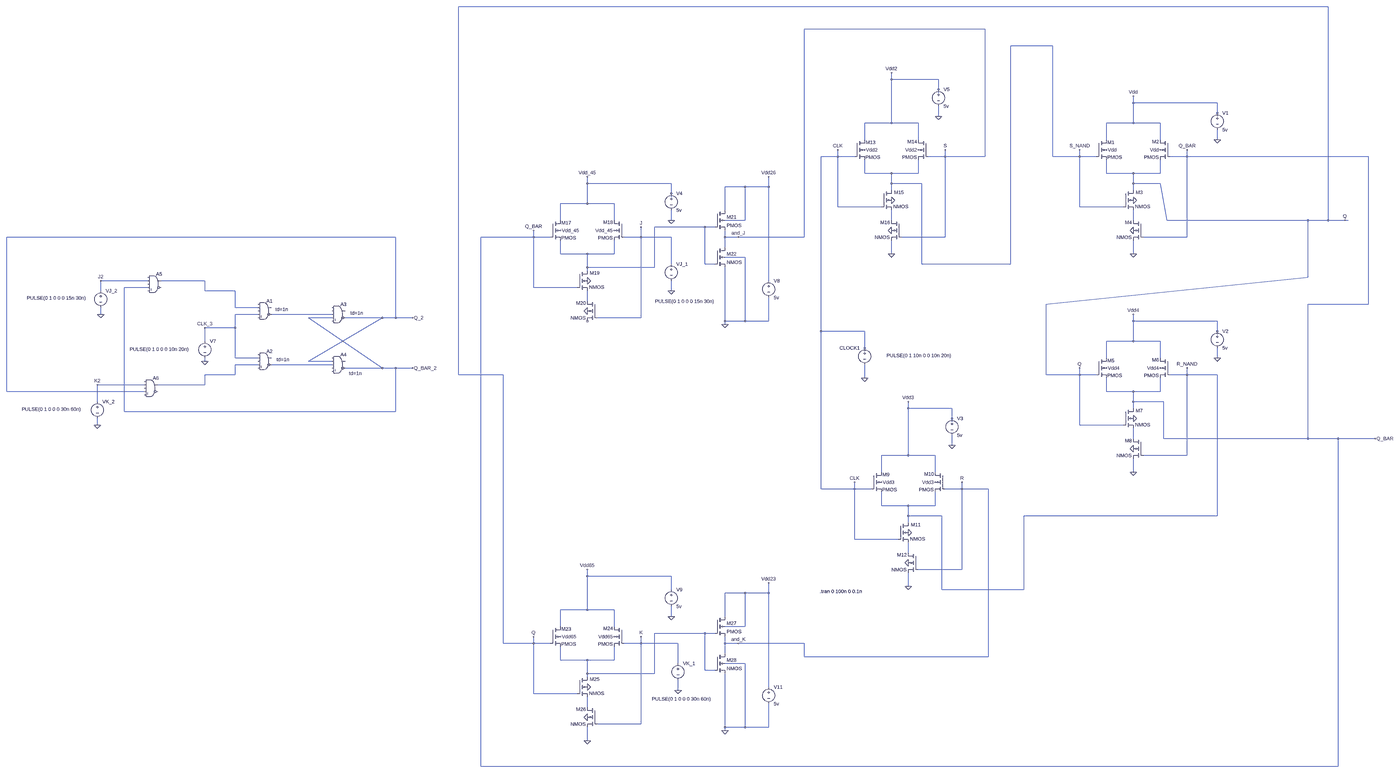
[diagram p0: schematic Latch-JK.asc, whole sheet]
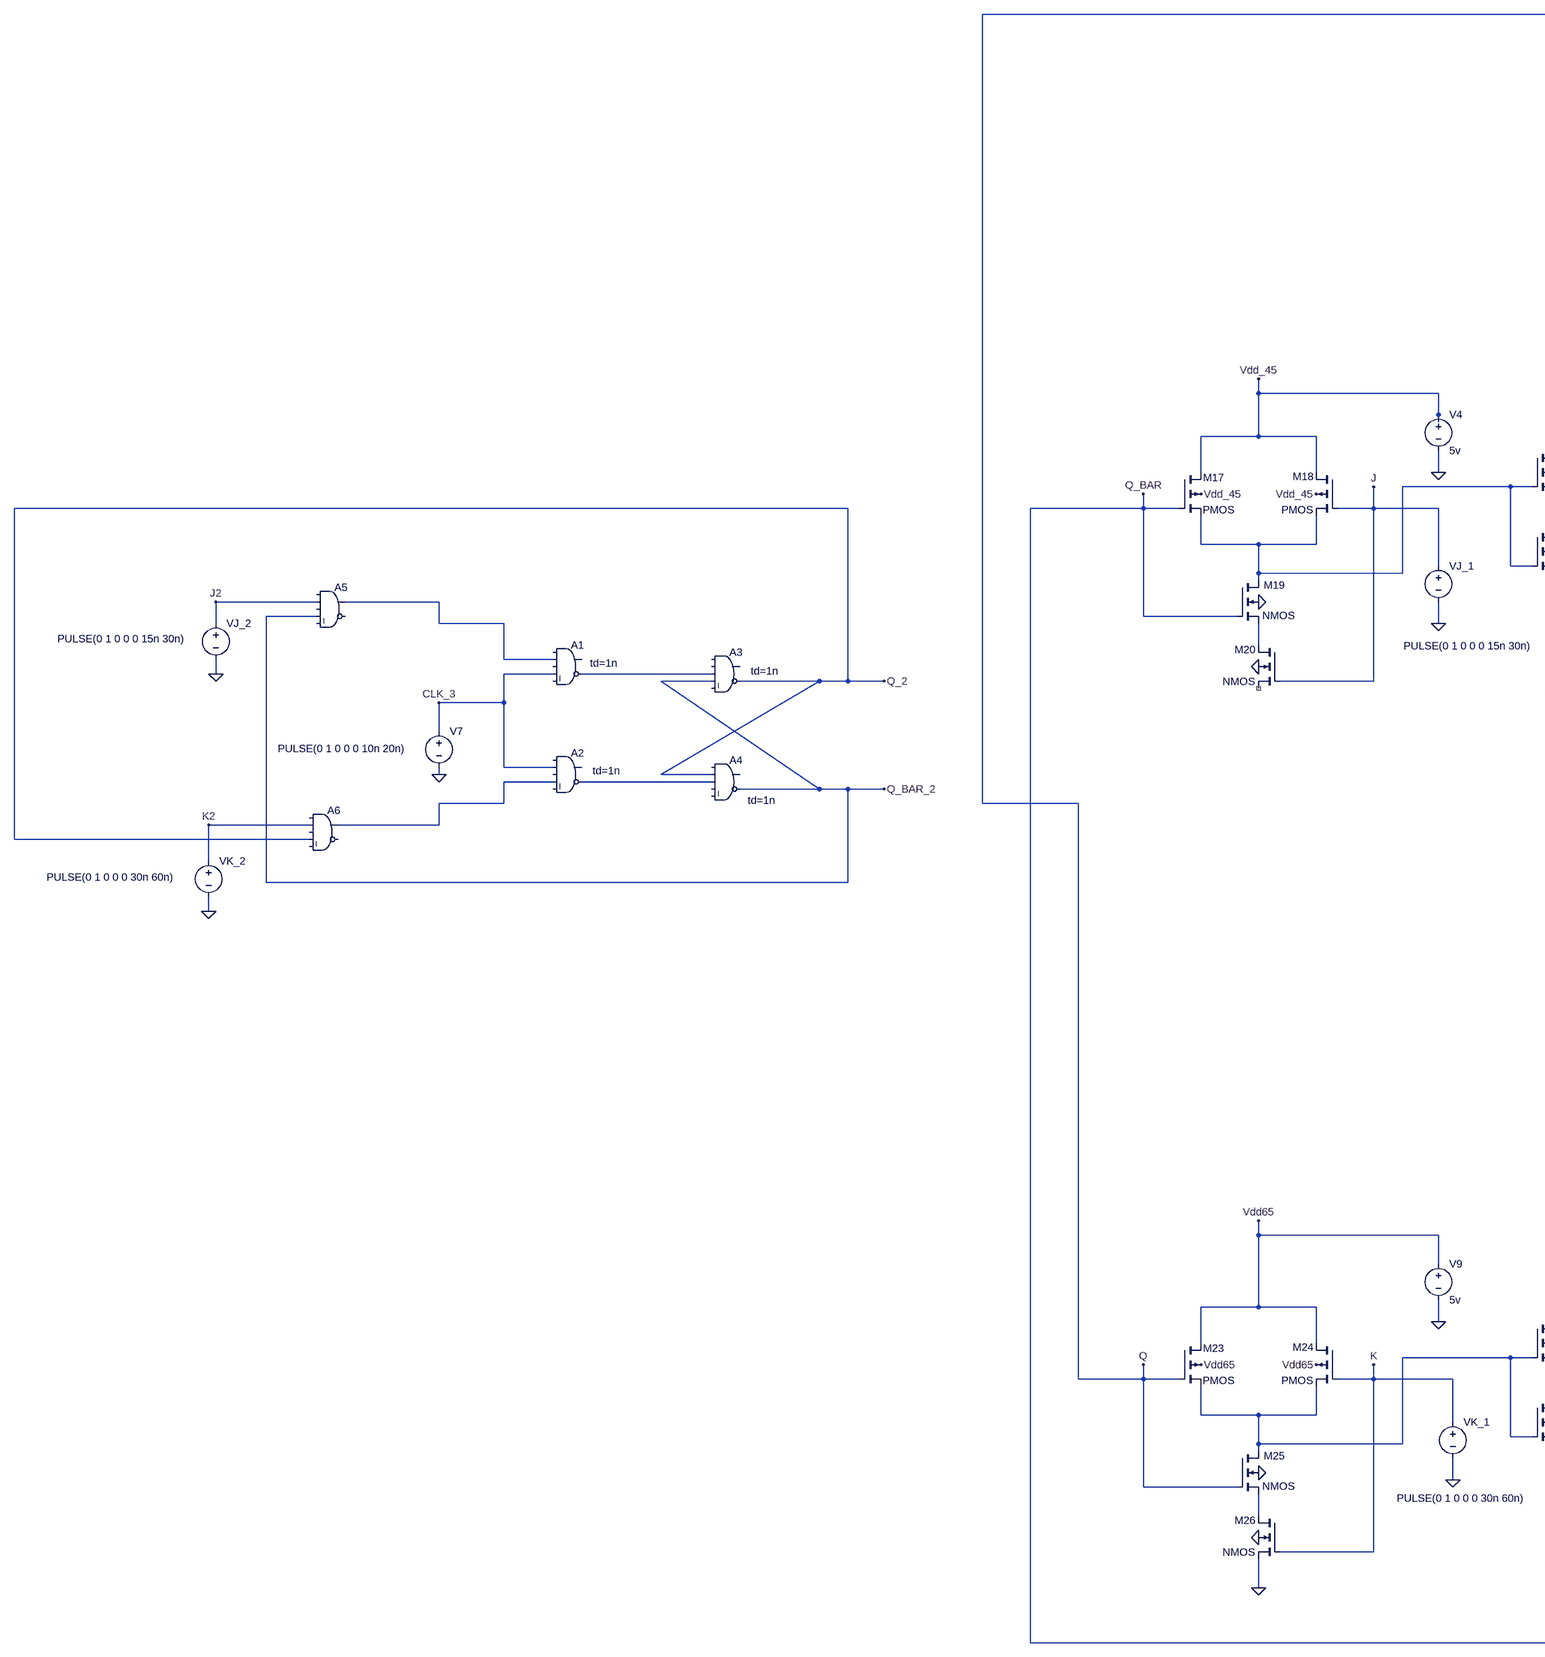
[diagram p1: schematic Latch-JK.asc, part, row 1 of 1, column 1 of 2]
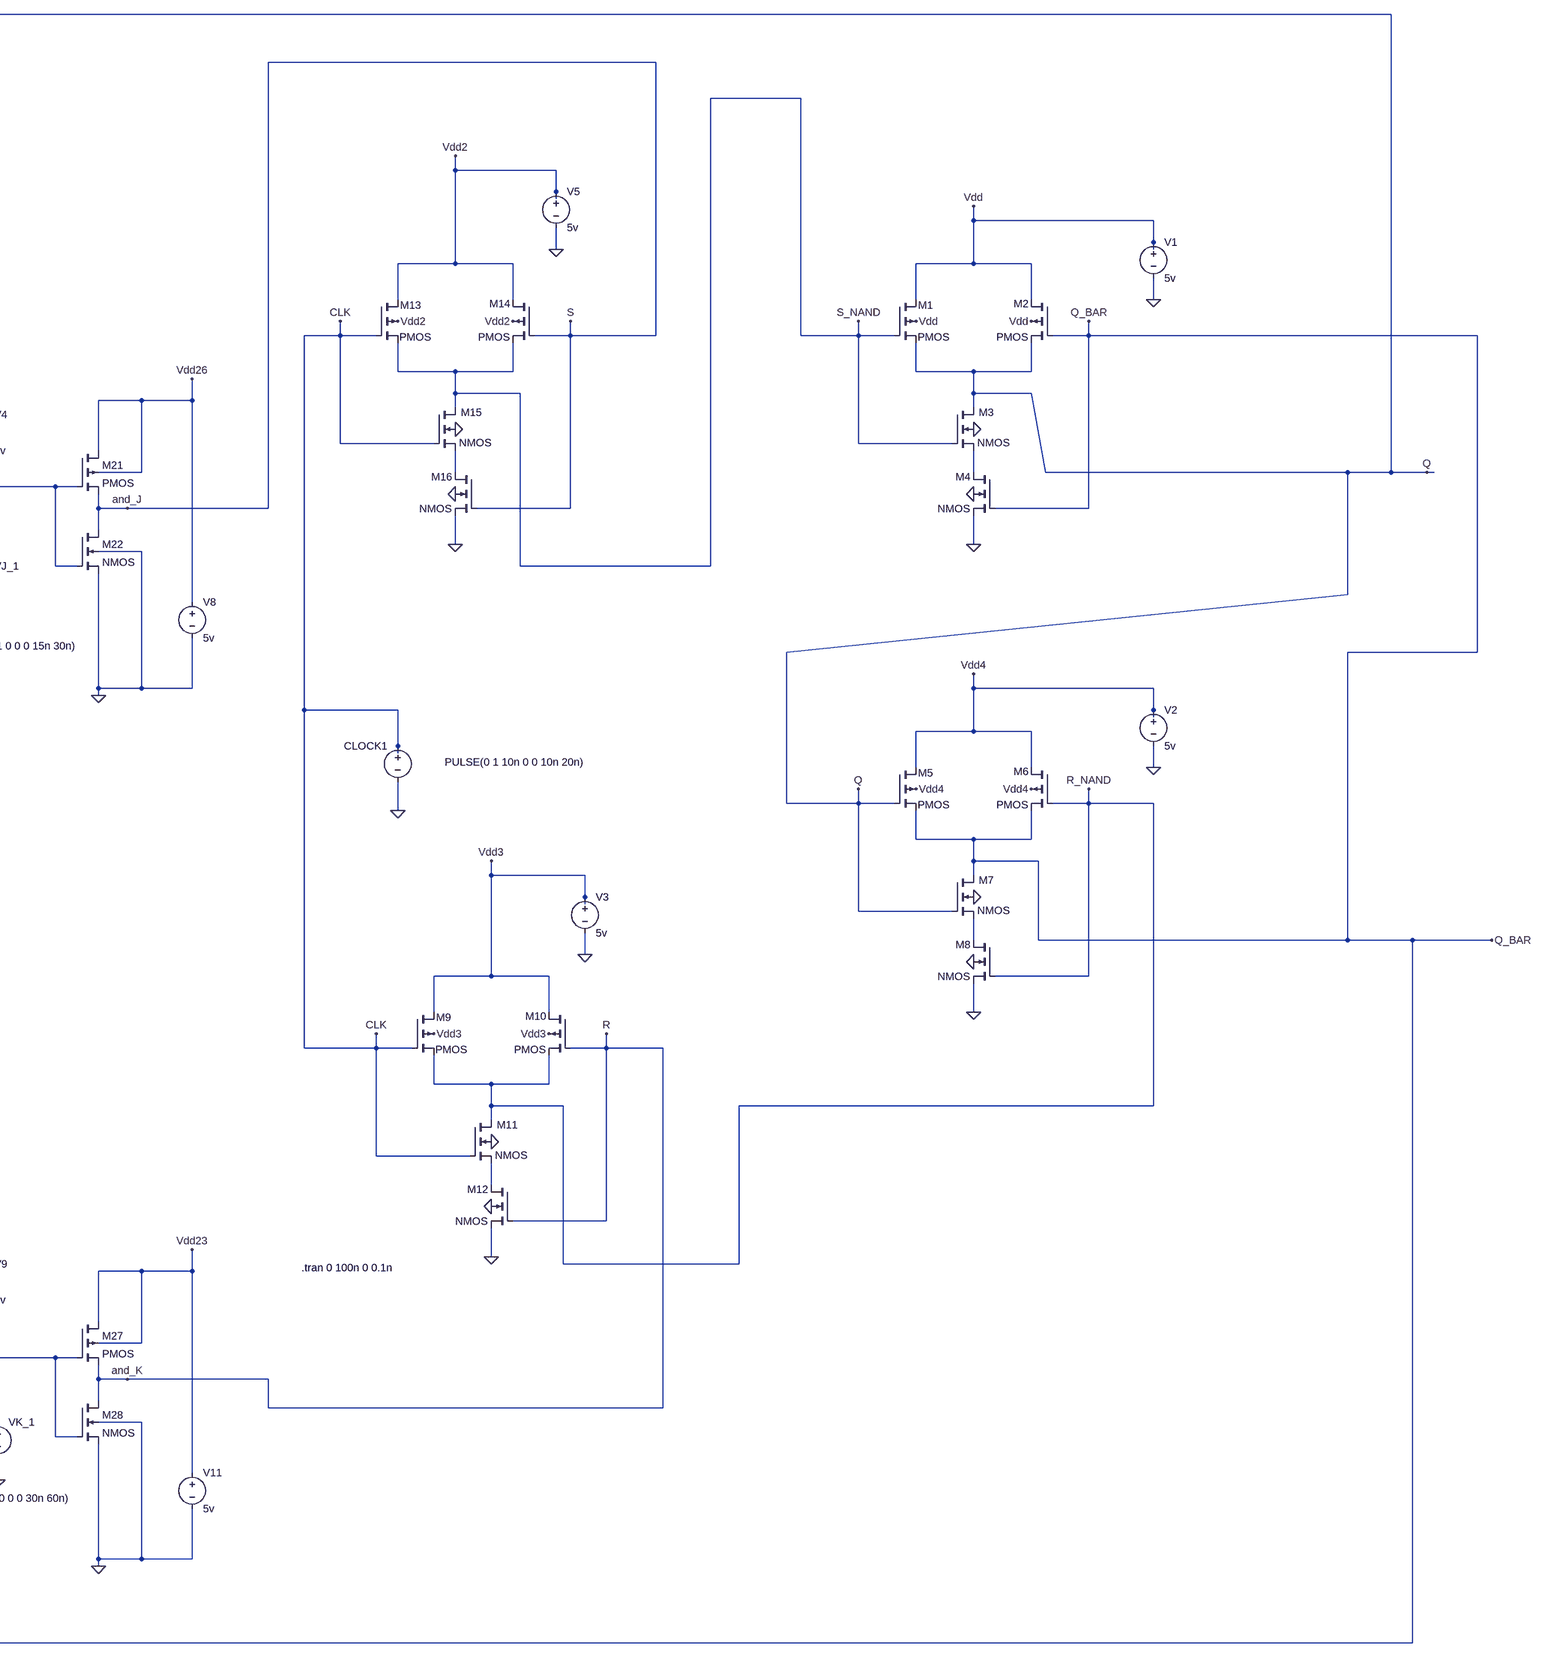
[diagram p2: schematic Latch-JK.asc, part, row 1 of 1, column 2 of 2]
Latch-JK.asc, the LTspice schematic file:
Version 4
SHEET 1 3092 2708
WIRE 2768 -1280 -2736 -1280
WIRE 480 -912 -400 -912
WIRE 1456 -832 608 -832
WIRE 16 -672 16 -704
WIRE 240 -672 16 -672
WIRE 240 -624 240 -672
WIRE 240 -608 240 -624
WIRE 1840 -560 1840 -592
WIRE 2240 -560 1840 -560
WIRE 2240 -512 2240 -560
WIRE 240 -496 240 -544
WIRE 2240 -496 2240 -512
WIRE 16 -464 16 -672
WIRE 16 -464 -112 -464
WIRE 144 -464 16 -464
WIRE 1840 -464 1840 -560
WIRE 1840 -464 1712 -464
WIRE 1968 -464 1840 -464
WIRE -112 -384 -112 -464
WIRE 144 -384 144 -464
WIRE 1712 -384 1712 -464
WIRE 1968 -384 1968 -464
WIRE 2240 -384 2240 -432
WIRE -240 -304 -240 -336
WIRE -240 -304 -320 -304
WIRE -160 -304 -240 -304
WIRE 272 -304 272 -336
WIRE 272 -304 192 -304
WIRE 480 -304 480 -912
WIRE 480 -304 272 -304
WIRE 1456 -304 1456 -832
WIRE 1584 -304 1584 -336
WIRE 1584 -304 1456 -304
WIRE 1664 -304 1584 -304
WIRE 2096 -304 2096 -336
WIRE 2096 -304 2016 -304
WIRE 2960 -304 2096 -304
WIRE -112 -224 -112 -288
WIRE 16 -224 -112 -224
WIRE 144 -224 144 -288
WIRE 144 -224 16 -224
WIRE 1712 -224 1712 -288
WIRE 1840 -224 1712 -224
WIRE 1968 -224 1968 -288
WIRE 1968 -224 1840 -224
WIRE -1520 -176 -1520 -208
WIRE -1120 -176 -1520 -176
WIRE 16 -176 16 -224
WIRE 160 -176 16 -176
WIRE 1840 -176 1840 -224
WIRE 1968 -176 1840 -176
WIRE -768 -160 -864 -160
WIRE -656 -160 -656 -208
WIRE -656 -160 -768 -160
WIRE 16 -144 16 -176
WIRE 1840 -144 1840 -176
WIRE -1120 -128 -1120 -176
WIRE -1120 -112 -1120 -128
WIRE -1520 -80 -1520 -176
WIRE -1520 -80 -1648 -80
WIRE -1392 -80 -1520 -80
WIRE -240 -64 -240 -304
WIRE -32 -64 -240 -64
WIRE 1584 -64 1584 -304
WIRE 1792 -64 1584 -64
WIRE -864 -48 -864 -160
WIRE -1648 0 -1648 -80
WIRE -1392 0 -1392 -80
WIRE -1120 0 -1120 -48
WIRE -768 0 -768 -160
WIRE -768 0 -864 0
WIRE 16 0 16 -48
WIRE 1840 0 1840 -48
WIRE 2000 0 1968 -176
WIRE 2672 0 2000 0
WIRE 2768 0 2768 -1280
WIRE 2768 0 2672 0
WIRE 2848 0 2768 0
WIRE 2864 0 2848 0
WIRE -960 32 -1200 32
WIRE -912 32 -960 32
WIRE -4928 80 -6800 80
WIRE -1776 80 -1776 48
WIRE -1776 80 -2384 80
WIRE -1696 80 -1776 80
WIRE -1264 80 -1264 32
WIRE -1264 80 -1344 80
WIRE -1120 80 -1264 80
WIRE -864 80 -864 48
WIRE -800 80 -864 80
WIRE -400 80 -400 -912
WIRE -400 80 -800 80
WIRE 272 80 272 -304
WIRE 272 80 64 80
WIRE 2096 80 2096 -304
WIRE 2096 80 1888 80
WIRE -864 128 -864 80
WIRE -1648 160 -1648 96
WIRE -1520 160 -1648 160
WIRE -1392 160 -1392 96
WIRE -1392 160 -1520 160
WIRE 16 160 16 96
WIRE 1840 160 1840 96
WIRE -768 176 -864 176
WIRE -1120 208 -1120 80
WIRE -960 208 -960 32
WIRE -912 208 -960 208
WIRE 160 208 160 -176
WIRE 608 208 608 -832
WIRE 608 208 160 208
WIRE -1520 224 -1520 160
WIRE -1200 224 -1200 32
WIRE -1200 224 -1520 224
WIRE -1520 240 -1520 224
WIRE 2672 272 2672 0
WIRE -6128 288 -6352 288
WIRE -5856 288 -6064 288
WIRE -656 288 -656 -160
WIRE -6128 320 -6240 320
WIRE -1776 320 -1776 80
WIRE -1568 320 -1776 320
WIRE -6352 336 -6352 288
WIRE -5856 336 -5856 288
WIRE -5712 336 -5856 336
WIRE -1120 336 -1120 288
WIRE -1520 384 -1520 336
WIRE 1424 400 2672 272
WIRE 2960 400 2960 -304
WIRE 2960 400 2672 400
WIRE -5712 416 -5712 336
WIRE -5584 416 -5712 416
WIRE -6352 448 -6352 416
WIRE -5584 448 -5712 448
WIRE -5232 448 -5520 448
WIRE -5232 464 -5344 464
WIRE -4992 464 -5168 464
WIRE -4928 464 -4928 80
WIRE -4928 464 -4992 464
WIRE -4848 464 -4928 464
WIRE -1264 464 -1264 80
WIRE -1264 464 -1472 464
WIRE -864 480 -864 224
WIRE -768 480 -768 176
WIRE -768 480 -864 480
WIRE -656 480 -656 368
WIRE -656 480 -768 480
WIRE 1840 480 1840 448
WIRE 2240 480 1840 480
WIRE -864 496 -864 480
WIRE -5712 512 -5712 448
WIRE -5712 512 -5856 512
WIRE -320 528 -320 -304
WIRE -112 528 -320 528
WIRE 2240 528 2240 480
WIRE 2240 544 2240 528
WIRE -5856 576 -5856 512
WIRE 1840 576 1840 480
WIRE 1840 576 1712 576
WIRE 1968 576 1840 576
WIRE -112 608 -112 528
WIRE -112 624 -112 608
WIRE -5712 656 -5712 512
WIRE -5584 656 -5712 656
WIRE 1712 656 1712 576
WIRE 1968 656 1968 576
WIRE 2240 656 2240 608
WIRE -5856 672 -5856 656
WIRE -5344 672 -4992 464
WIRE -5232 672 -5344 672
WIRE -5584 688 -5712 688
WIRE -5232 688 -5520 688
WIRE -4992 704 -5344 464
WIRE -4992 704 -5168 704
WIRE -4928 704 -4992 704
WIRE -4848 704 -4928 704
WIRE -5712 736 -5712 688
WIRE -5712 736 -5856 736
WIRE -2736 736 -2736 -1280
WIRE -1936 736 -2736 736
WIRE 1424 736 1424 400
WIRE 1584 736 1584 704
WIRE 1584 736 1424 736
WIRE 1664 736 1584 736
WIRE 2096 736 2096 704
WIRE 2096 736 2016 736
WIRE 2240 736 2096 736
WIRE -112 752 -112 688
WIRE -6144 784 -6368 784
WIRE -5856 784 -5856 736
WIRE -5856 784 -6080 784
WIRE -6800 816 -6800 80
WIRE -6144 816 -6800 816
WIRE 1712 816 1712 752
WIRE 1840 816 1712 816
WIRE 1968 816 1968 752
WIRE 1968 816 1840 816
WIRE -6368 864 -6368 784
WIRE 1840 864 1840 816
WIRE 1984 864 1840 864
WIRE 96 896 96 864
WIRE 304 896 96 896
WIRE 1840 896 1840 864
WIRE -6240 912 -6240 320
WIRE -4928 912 -4928 704
WIRE -4928 912 -6240 912
WIRE 304 944 304 896
WIRE 304 960 304 944
WIRE -6368 976 -6368 944
WIRE 1584 976 1584 736
WIRE 1792 976 1584 976
WIRE 1840 1040 1840 992
WIRE 1984 1040 1984 864
WIRE 2672 1040 2672 400
WIRE 2672 1040 1984 1040
WIRE 2816 1040 2672 1040
WIRE 2992 1040 2816 1040
WIRE 304 1072 304 1024
WIRE 96 1120 96 896
WIRE 96 1120 -32 1120
WIRE 224 1120 96 1120
WIRE 2096 1120 2096 736
WIRE 2096 1120 1888 1120
WIRE -32 1200 -32 1120
WIRE 224 1200 224 1120
WIRE 1840 1200 1840 1136
WIRE -320 1280 -320 528
WIRE -160 1280 -160 1248
WIRE -160 1280 -320 1280
WIRE -80 1280 -160 1280
WIRE 352 1280 352 1248
WIRE 352 1280 272 1280
WIRE 496 1280 352 1280
WIRE -32 1360 -32 1296
WIRE 96 1360 -32 1360
WIRE 224 1360 224 1296
WIRE 224 1360 96 1360
WIRE 96 1408 96 1360
WIRE 256 1408 96 1408
WIRE 2240 1408 2240 736
WIRE 2240 1408 672 1408
WIRE 96 1440 96 1408
WIRE -160 1520 -160 1280
WIRE 48 1520 -160 1520
WIRE 96 1584 96 1536
WIRE 352 1664 352 1280
WIRE 352 1664 144 1664
WIRE -1520 1696 -1520 1664
WIRE -1120 1696 -1520 1696
WIRE 96 1744 96 1680
WIRE -1120 1760 -1120 1696
WIRE 256 1760 256 1408
WIRE 672 1760 672 1408
WIRE 672 1760 256 1760
WIRE -768 1776 -864 1776
WIRE -656 1776 -656 1728
WIRE -656 1776 -768 1776
WIRE -1520 1856 -1520 1696
WIRE -1520 1856 -1648 1856
WIRE -1392 1856 -1520 1856
WIRE -1120 1888 -1120 1840
WIRE -864 1888 -864 1776
WIRE -1648 1936 -1648 1856
WIRE -1392 1936 -1392 1856
WIRE -768 1936 -768 1776
WIRE -768 1936 -864 1936
WIRE -960 1968 -1200 1968
WIRE -912 1968 -960 1968
WIRE -1936 2016 -1936 736
WIRE -1776 2016 -1776 1984
WIRE -1776 2016 -1936 2016
WIRE -1696 2016 -1776 2016
WIRE -1264 2016 -1264 1984
WIRE -1264 2016 -1344 2016
WIRE -1088 2016 -1264 2016
WIRE -864 2016 -864 1984
WIRE -800 2016 -864 2016
WIRE -400 2016 -800 2016
WIRE -864 2064 -864 2016
WIRE -400 2080 -400 2016
WIRE 496 2080 496 1280
WIRE 496 2080 -400 2080
WIRE -1648 2096 -1648 2032
WIRE -1520 2096 -1648 2096
WIRE -1392 2096 -1392 2032
WIRE -1392 2096 -1520 2096
WIRE -1088 2112 -1088 2016
WIRE -768 2112 -864 2112
WIRE -960 2144 -960 1968
WIRE -912 2144 -960 2144
WIRE -1520 2160 -1520 2096
WIRE -1200 2160 -1200 1968
WIRE -1200 2160 -1520 2160
WIRE -1520 2176 -1520 2160
WIRE -656 2224 -656 1776
WIRE -1088 2240 -1088 2192
WIRE -1776 2256 -1776 2016
WIRE -1568 2256 -1776 2256
WIRE -1520 2320 -1520 2272
WIRE -1264 2400 -1264 2016
WIRE -1264 2400 -1472 2400
WIRE -864 2416 -864 2160
WIRE -768 2416 -768 2112
WIRE -768 2416 -864 2416
WIRE -656 2416 -656 2304
WIRE -656 2416 -768 2416
WIRE -864 2432 -864 2416
WIRE -1520 2480 -1520 2416
WIRE -2384 2704 -2384 80
WIRE 2816 2704 2816 1040
WIRE 2816 2704 -2384 2704
FLAG 1840 160 0
FLAG 1840 -592 Vdd
FLAG 1712 -336 Vdd
FLAG 1968 -336 Vdd
FLAG 1584 -336 S_NAND
FLAG 2096 -336 Q_BAR
FLAG 2240 -384 0
FLAG 1840 -96 0
FLAG 1840 48 0
FLAG 1840 1200 0
FLAG 1840 448 Vdd4
FLAG 1712 704 Vdd4
FLAG 1968 704 Vdd4
FLAG 1584 704 Q
FLAG 2096 704 R_NAND
FLAG 2240 656 0
FLAG 1840 944 0
FLAG 1840 1088 0
FLAG 2848 0 Q
FLAG 2992 1040 Q_BAR
FLAG 96 1744 0
FLAG -1088 2240 0
FLAG 96 864 Vdd3
FLAG -32 1248 Vdd3
FLAG 224 1248 Vdd3
FLAG -160 1248 CLK
FLAG 352 1248 R
FLAG 304 1072 0
FLAG 96 1488 0
FLAG 96 1632 0
FLAG 16 160 0
FLAG -1120 336 0
FLAG -112 752 0
FLAG 16 -704 Vdd2
FLAG -112 -336 Vdd2
FLAG 144 -336 Vdd2
FLAG -240 -336 CLK
FLAG 272 -336 S
FLAG 240 -496 0
FLAG 16 -96 0
FLAG 16 48 0
FLAG -4848 464 Q_2
FLAG -4848 704 Q_BAR_2
FLAG -5856 672 0
FLAG -6352 448 0
FLAG -6368 976 0
FLAG -6352 288 J2
FLAG -6368 784 K2
FLAG -1520 -208 Vdd_45
FLAG -1648 48 Vdd_45
FLAG -1392 48 Vdd_45
FLAG -1776 48 Q_BAR
FLAG -1264 32 J
FLAG -1120 0 0
FLAG -1520 288 0
FLAG -1520 432 0
FLAG -864 496 0
FLAG -656 -208 Vdd26
FLAG -800 80 and_J
FLAG -1520 2480 0
FLAG -1520 1664 Vdd65
FLAG -1648 1984 Vdd65
FLAG -1392 1984 Vdd65
FLAG -1776 1984 Q
FLAG -1264 1984 K
FLAG -1120 1888 0
FLAG -1520 2224 0
FLAG -1520 2368 0
FLAG -864 2432 0
FLAG -656 1728 Vdd23
FLAG -800 2016 and_K
FLAG -5856 512 CLK_3
SYMBOL pmos4 1664 -384 R0
WINDOW 0 53 12 Left 2
WINDOW 3 52 83 Left 2
SYMATTR InstName M1
SYMATTR Value2 l=0.6u w=6u
SYMBOL pmos4 2016 -384 M0
WINDOW 0 53 9 Left 2
WINDOW 3 55 83 Left 2
SYMATTR InstName M2
SYMATTR Value2 l=0.6u w=6u
SYMBOL nmos4 1792 -144 R0
WINDOW 0 60 11 Left 2
WINDOW 3 56 78 Left 2
SYMATTR InstName M3
SYMATTR Value2 l=0.6u w=3u
SYMBOL nmos4 1888 0 M0
WINDOW 0 54 10 Left 2
WINDOW 3 56 81 Left 2
SYMATTR InstName M4
SYMATTR Value2 l=0.6u w=3u
SYMBOL voltage 2240 -528 R0
WINDOW 123 0 0 Left 0
WINDOW 39 0 0 Left 0
SYMATTR InstName V1
SYMATTR Value 5v
SYMBOL pmos4 1664 656 R0
WINDOW 0 53 12 Left 2
WINDOW 3 52 83 Left 2
SYMATTR InstName M5
SYMATTR Value2 l=0.6u w=6u
SYMBOL pmos4 2016 656 M0
WINDOW 0 53 9 Left 2
WINDOW 3 55 83 Left 2
SYMATTR InstName M6
SYMATTR Value2 l=0.6u w=6u
SYMBOL nmos4 1792 896 R0
WINDOW 0 60 11 Left 2
WINDOW 3 56 78 Left 2
SYMATTR InstName M7
SYMATTR Value2 l=0.6u w=3u
SYMBOL nmos4 1888 1040 M0
WINDOW 0 54 10 Left 2
WINDOW 3 56 81 Left 2
SYMATTR InstName M8
SYMATTR Value2 l=0.6u w=3u
SYMBOL voltage 2240 512 R0
WINDOW 123 0 0 Left 0
WINDOW 39 0 0 Left 0
SYMATTR InstName V2
SYMATTR Value 5v
SYMBOL pmos4 -80 1200 R0
WINDOW 0 53 12 Left 2
WINDOW 3 52 83 Left 2
SYMATTR InstName M9
SYMATTR Value2 l=0.6u w=6u
SYMBOL pmos4 272 1200 M0
WINDOW 0 53 9 Left 2
WINDOW 3 55 83 Left 2
SYMATTR InstName M10
SYMATTR Value2 l=0.6u w=6u
SYMBOL nmos4 48 1440 R0
WINDOW 0 60 11 Left 2
WINDOW 3 56 78 Left 2
SYMATTR InstName M11
SYMATTR Value2 l=0.6u w=3u
SYMBOL nmos4 144 1584 M0
WINDOW 0 54 10 Left 2
WINDOW 3 56 81 Left 2
SYMATTR InstName M12
SYMATTR Value2 l=0.6u w=3u
SYMBOL voltage 304 928 R0
WINDOW 123 0 0 Left 0
WINDOW 39 0 0 Left 0
SYMATTR InstName V3
SYMATTR Value 5v
SYMBOL voltage -1088 2096 R0
WINDOW 3 159 185 Right 2
WINDOW 123 0 0 Left 0
WINDOW 39 0 0 Left 0
SYMATTR Value PULSE(0 1 0 0 0 30n 60n)
SYMATTR InstName VK_1
SYMBOL voltage -112 592 M0
WINDOW 3 -415 52 Left 2
WINDOW 123 0 0 Left 0
WINDOW 39 0 0 Left 0
SYMATTR Value PULSE(0 1 10n 0 0 10n 20n)
SYMATTR InstName CLOCK1
SYMBOL pmos4 -160 -384 R0
WINDOW 0 53 12 Left 2
WINDOW 3 52 83 Left 2
SYMATTR InstName M13
SYMATTR Value2 l=0.6u w=6u
SYMBOL pmos4 192 -384 M0
WINDOW 0 53 9 Left 2
WINDOW 3 55 83 Left 2
SYMATTR InstName M14
SYMATTR Value2 l=0.6u w=6u
SYMBOL nmos4 -32 -144 R0
WINDOW 0 60 11 Left 2
WINDOW 3 56 78 Left 2
SYMATTR InstName M15
SYMATTR Value2 l=0.6u w=3u
SYMBOL nmos4 64 0 M0
WINDOW 0 54 10 Left 2
WINDOW 3 56 81 Left 2
SYMATTR InstName M16
SYMATTR Value2 l=0.6u w=3u
SYMBOL voltage 240 -640 R0
WINDOW 123 0 0 Left 0
WINDOW 39 0 0 Left 0
SYMATTR InstName V5
SYMATTR Value 5v
SYMBOL voltage -1120 192 R0
WINDOW 3 206 194 Right 2
WINDOW 123 0 0 Left 0
WINDOW 39 0 0 Left 0
SYMATTR Value PULSE(0 1 0 0 0 15n 30n)
SYMATTR InstName VJ_1
SYMBOL voltage -5856 560 R0
WINDOW 3 -358 54 Left 2
WINDOW 123 0 0 Left 0
WINDOW 39 0 0 Left 0
SYMATTR InstName V7
SYMATTR Value PULSE(0 1 0 0 0 10n 20n)
SYMBOL Digital\\and -5552 368 R0
WINDOW 3 50 56 Left 2
SYMATTR InstName A1
SYMATTR Value td=1n
SYMBOL Digital\\and -5552 608 R0
WINDOW 3 56 55 Left 2
SYMATTR InstName A2
SYMATTR Value td=1n
SYMBOL Digital\\and -5200 384 R0
WINDOW 3 56 58 Left 2
SYMATTR InstName A3
SYMATTR Value td=1n
SYMBOL Digital\\and -5200 624 R0
WINDOW 3 49 105 Left 2
SYMATTR InstName A4
SYMATTR Value td=1n
SYMBOL voltage -6352 320 R0
WINDOW 3 -352 50 Left 2
WINDOW 123 0 0 Left 0
WINDOW 39 0 0 Left 0
SYMATTR InstName VJ_2
SYMATTR Value PULSE(0 1 0 0 0 15n 30n)
SYMBOL voltage -6368 848 R0
WINDOW 3 -360 52 Left 2
WINDOW 123 0 0 Left 0
WINDOW 39 0 0 Left 0
SYMATTR InstName VK_2
SYMATTR Value PULSE(0 1 0 0 0 30n 60n)
SYMBOL pmos4 -1696 0 R0
WINDOW 0 53 12 Left 2
WINDOW 3 52 83 Left 2
SYMATTR InstName M17
SYMATTR Value2 l=0.6u w=6u
SYMBOL pmos4 -1344 0 M0
WINDOW 0 53 9 Left 2
WINDOW 3 55 83 Left 2
SYMATTR InstName M18
SYMATTR Value2 l=0.6u w=6u
SYMBOL nmos4 -1568 240 R0
WINDOW 0 60 11 Left 2
WINDOW 3 56 78 Left 2
SYMATTR InstName M19
SYMATTR Value2 l=0.6u w=3u
SYMBOL nmos4 -1472 384 M0
WINDOW 0 54 10 Left 2
WINDOW 3 56 81 Left 2
SYMATTR InstName M20
SYMATTR Value2 l=0.6u w=3u
SYMBOL voltage -1120 -144 R0
WINDOW 123 0 0 Left 0
WINDOW 39 0 0 Left 0
SYMATTR InstName V4
SYMATTR Value 5v
SYMBOL pmos4 -912 -48 R0
SYMATTR InstName M21
SYMATTR Value2 l=0.6u w=6u
SYMBOL nmos4 -912 128 R0
SYMATTR InstName M22
SYMATTR Value2 l=0.6u w=3u
SYMBOL voltage -656 272 R0
WINDOW 123 0 0 Left 0
WINDOW 39 0 0 Left 0
SYMATTR InstName V8
SYMATTR Value 5v
SYMBOL pmos4 -1696 1936 R0
WINDOW 0 53 12 Left 2
WINDOW 3 52 83 Left 2
SYMATTR InstName M23
SYMATTR Value2 l=0.6u w=6u
SYMBOL pmos4 -1344 1936 M0
WINDOW 0 53 9 Left 2
WINDOW 3 55 83 Left 2
SYMATTR InstName M24
SYMATTR Value2 l=0.6u w=6u
SYMBOL nmos4 -1568 2176 R0
WINDOW 0 60 11 Left 2
WINDOW 3 56 78 Left 2
SYMATTR InstName M25
SYMATTR Value2 l=0.6u w=3u
SYMBOL nmos4 -1472 2320 M0
WINDOW 0 54 10 Left 2
WINDOW 3 56 81 Left 2
SYMATTR InstName M26
SYMATTR Value2 l=0.6u w=3u
SYMBOL voltage -1120 1744 R0
WINDOW 123 0 0 Left 0
WINDOW 39 0 0 Left 0
SYMATTR InstName V9
SYMATTR Value 5v
SYMBOL pmos4 -912 1888 R0
SYMATTR InstName M27
SYMATTR Value2 l=0.6u w=6u
SYMBOL nmos4 -912 2064 R0
SYMATTR InstName M28
SYMATTR Value2 l=0.6u w=3u
SYMBOL voltage -656 2208 R0
WINDOW 123 0 0 Left 0
WINDOW 39 0 0 Left 0
SYMATTR InstName V11
SYMATTR Value 5v
SYMBOL Digital\\and -6096 240 R0
SYMATTR InstName A5
SYMBOL Digital\\and -6112 736 R0
SYMATTR InstName A6
TEXT -326 1768 Left 2 !.tran 0 100n 0 0.1n

The netlist it stands for:
* Latch-JK.asc
M1 Vdd S_NAND Q Vdd PMOS l=0.6u w=6u
M2 Vdd Q_BAR Q Vdd PMOS l=0.6u w=6u
M3 Q S_NAND N002 0 NMOS l=0.6u w=3u
M4 N002 Q_BAR 0 0 NMOS l=0.6u w=3u
V1 Vdd 0 5v
M5 Vdd4 Q Q_BAR Vdd4 PMOS l=0.6u w=6u
M6 Vdd4 R_NAND Q_BAR Vdd4 PMOS l=0.6u w=6u
M7 Q_BAR Q N009 0 NMOS l=0.6u w=3u
M8 N009 R_NAND 0 0 NMOS l=0.6u w=3u
V2 Vdd4 0 5v
M9 Vdd3 CLK R_NAND Vdd3 PMOS l=0.6u w=6u
M10 Vdd3 and_K R_NAND Vdd3 PMOS l=0.6u w=6u
M11 R_NAND CLK N010 0 NMOS l=0.6u w=3u
M12 N010 and_K 0 0 NMOS l=0.6u w=3u
V3 Vdd3 0 5v
VK_1 K 0 PULSE(0 1 0 0 0 30n 60n)
V§CLOCK1 CLK 0 PULSE(0 1 10n 0 0 10n 20n)
M13 Vdd2 CLK S_NAND Vdd2 PMOS l=0.6u w=6u
M14 Vdd2 and_J S_NAND Vdd2 PMOS l=0.6u w=6u
M15 S_NAND CLK N001 0 NMOS l=0.6u w=3u
M16 N001 and_J 0 0 NMOS l=0.6u w=3u
V5 Vdd2 0 5v
VJ_1 J 0 PULSE(0 1 0 0 0 15n 30n)
V7 CLK_3 0 PULSE(0 1 0 0 0 10n 20n)
A1 0 N004 0 CLK_3 0 N006 0 0 AND td=1n
A2 0 CLK_3 0 N007 0 N008 0 0 AND td=1n
A3 0 0 N006 Q_BAR_2 0 Q_2 0 0 AND td=1n
A4 0 Q_2 N008 0 0 Q_BAR_2 0 0 AND td=1n
VJ_2 J2 0 PULSE(0 1 0 0 0 15n 30n)
VK_2 K2 0 PULSE(0 1 0 0 0 30n 60n)
M17 Vdd_45 Q_BAR N003 Vdd_45 PMOS l=0.6u w=6u
M18 Vdd_45 J N003 Vdd_45 PMOS l=0.6u w=6u
M19 N003 Q_BAR N005 0 NMOS l=0.6u w=3u
M20 N005 J NC_01 0 NMOS l=0.6u w=3u
V4 Vdd_45 0 5v
M21 Vdd26 N003 and_J Vdd26 PMOS l=0.6u w=6u
M22 and_J N003 0 0 NMOS l=0.6u w=3u
V8 Vdd26 0 5v
M23 Vdd65 Q N011 Vdd65 PMOS l=0.6u w=6u
M24 Vdd65 K N011 Vdd65 PMOS l=0.6u w=6u
M25 N011 Q N012 0 NMOS l=0.6u w=3u
M26 N012 K 0 0 NMOS l=0.6u w=3u
V9 Vdd65 0 5v
M27 Vdd23 N011 and_K Vdd23 PMOS l=0.6u w=6u
M28 and_K N011 0 0 NMOS l=0.6u w=3u
V11 Vdd23 0 5v
A5 0 J2 0 Q_BAR_2 0 0 N004 0 AND
A6 0 K2 0 Q_2 0 0 N007 0 AND
.model NMOS NMOS
.model PMOS PMOS
.lib standard.mos
.tran 0 100n 0 0.1n
.backanno
.end